# EAGLE design SparkFun-Wearable-Shield-For-Photon (EAGLE 7.1.0)
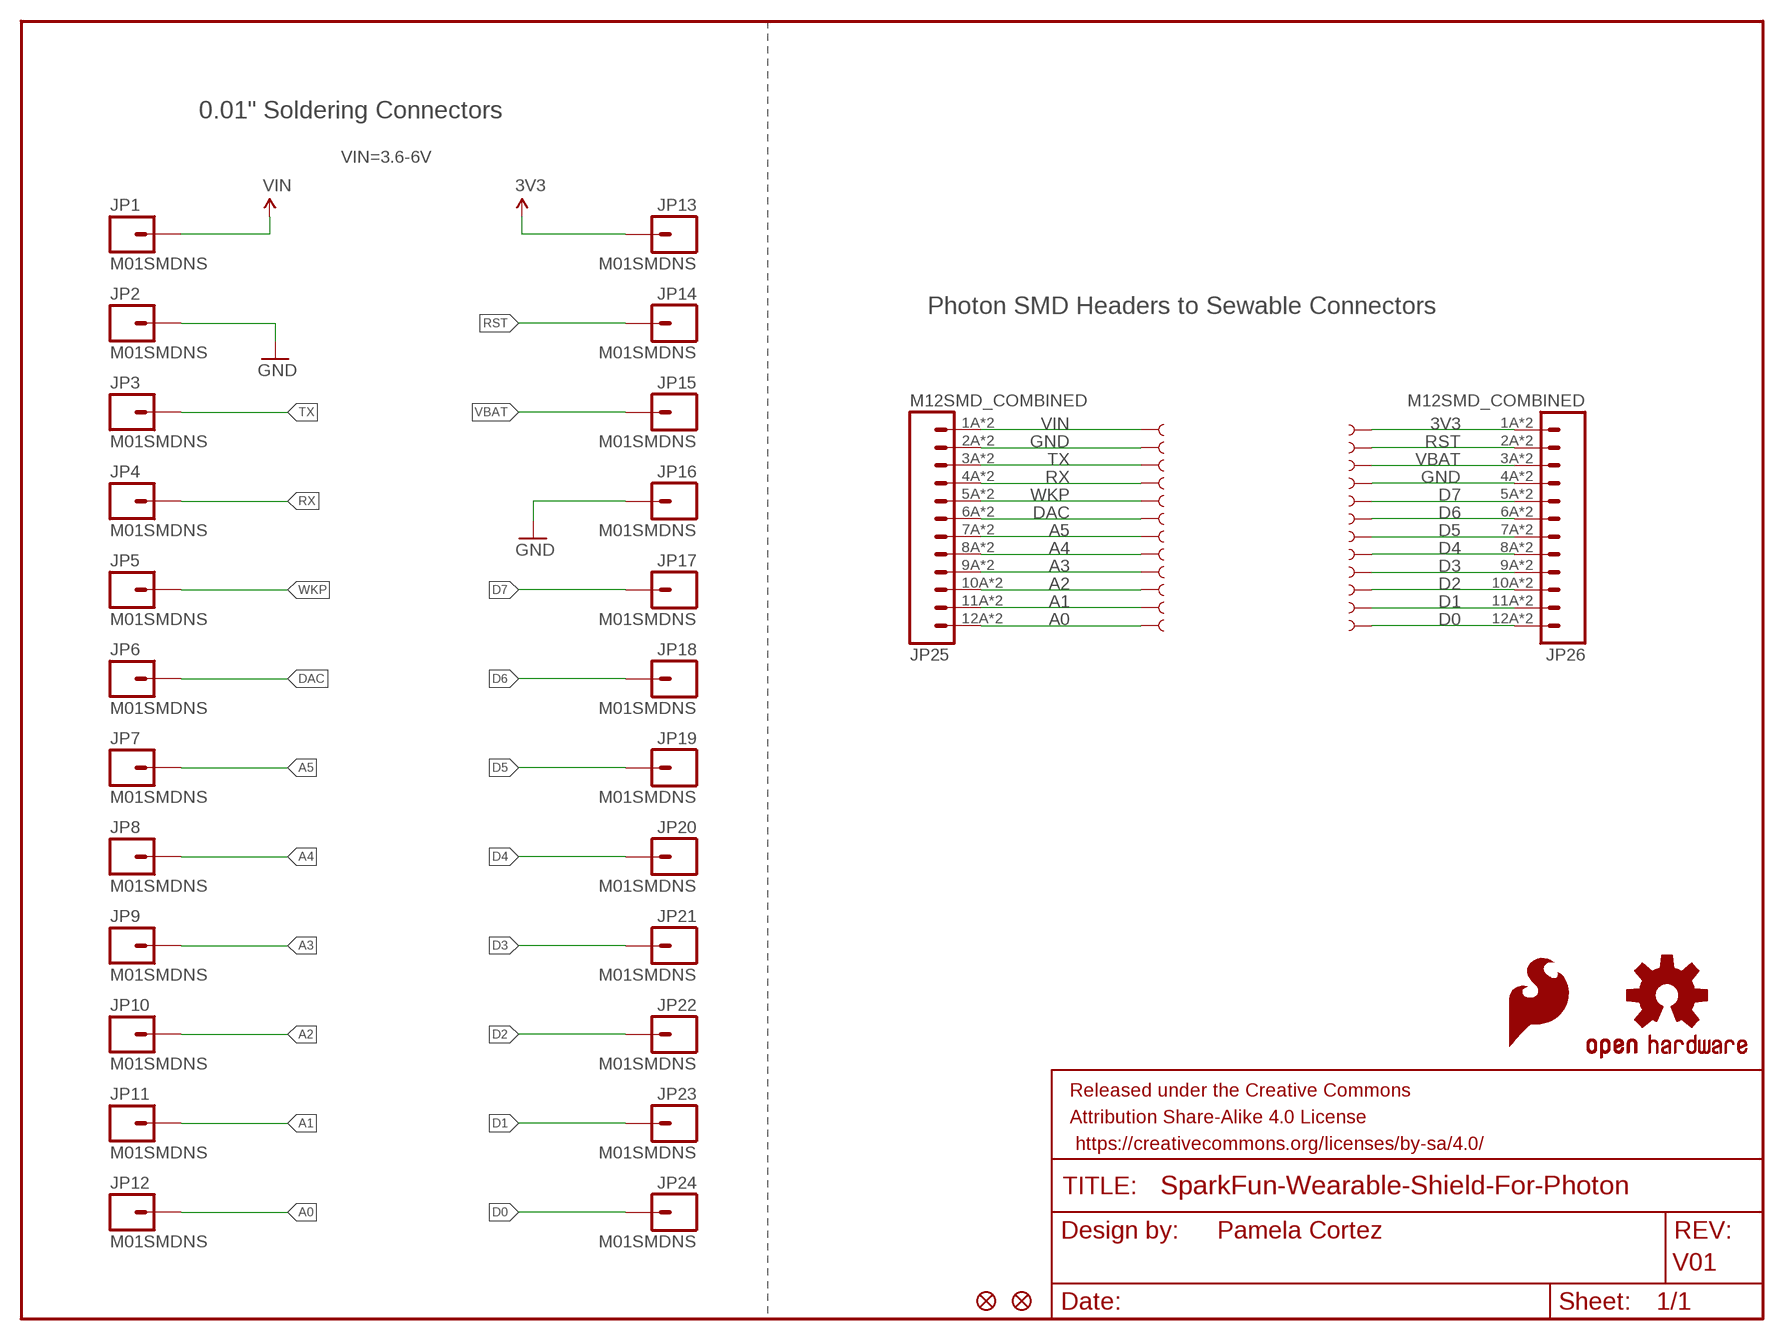
[diagram p0: schematic, sheet 1]

## Parts
FID1  FIDUCIAL1X2  [FIDUCIAL-1X2]
FID2  FIDUCIAL1X2  [FIDUCIAL-1X2]
FRAME1  FRAME-LETTER  [CREATIVE_COMMONS]
J1  PAD  [PAD-LONG-2-SIDED]
J2  PAD  [PAD-LONG-2-SIDED]
J3  PAD  [PAD-LONG-2-SIDED]
J4  PAD  [PAD-LONG-2-SIDED]
J5  PAD  [PAD-LONG-2-SIDED]
J6  PAD  [PAD-LONG-2-SIDED]
J7  PAD  [PAD-LONG-2-SIDED]
J8  PAD  [PAD-LONG-2-SIDED]
J9  PAD  [PAD-LONG-2-SIDED]
J10  PAD  [PAD-LONG-2-SIDED]
J11  PAD  [PAD-LONG-2-SIDED]
J12  PAD  [PAD-LONG-2-SIDED]
J13  PAD  [PAD-LONG-2-SIDED]
J14  PAD  [PAD-LONG-2-SIDED]
J15  PAD  [PAD-LONG-2-SIDED]
J16  PAD  [PAD-LONG-2-SIDED]
J17  PAD  [PAD-LONG-2-SIDED]
J18  PAD  [PAD-LONG-2-SIDED]
J19  PAD  [PAD-LONG-2-SIDED]
J20  PAD  [PAD-LONG-2-SIDED]
J21  PAD  [PAD-LONG-2-SIDED]
J22  PAD  [PAD-LONG-2-SIDED]
J23  PAD  [PAD-LONG-2-SIDED]
J24  PAD  [PAD-LONG-2-SIDED]
JP1  M01SMDNS  [1X01NS]
JP2  M01SMDNS  [1X01NS]
JP3  M01SMDNS  [1X01NS]
JP4  M01SMDNS  [1X01NS]
JP5  M01SMDNS  [1X01NS]
JP6  M01SMDNS  [1X01NS]
JP7  M01SMDNS  [1X01NS]
JP8  M01SMDNS  [1X01NS]
JP9  M01SMDNS  [1X01NS]
JP10  M01SMDNS  [1X01NS]
JP11  M01SMDNS  [1X01NS]
JP12  M01SMDNS  [1X01NS]
JP13  M01SMDNS  [1X01NS]
JP14  M01SMDNS  [1X01NS]
JP15  M01SMDNS  [1X01NS]
JP16  M01SMDNS  [1X01NS]
JP17  M01SMDNS  [1X01NS]
JP18  M01SMDNS  [1X01NS]
JP19  M01SMDNS  [1X01NS]
JP20  M01SMDNS  [1X01NS]
JP21  M01SMDNS  [1X01NS]
JP22  M01SMDNS  [1X01NS]
JP23  M01SMDNS  [1X01NS]
JP24  M01SMDNS  [1X01NS]
JP25  M12SMD_COMBINED  [1X12_SMD_COMBINED]
JP26  M12SMD_COMBINED  [1X12_SMD_COMBINED]
LOGO1  SFE_LOGO_FLAME.2_INCH  [SFE_LOGO_FLAME_.2]
LOGO2  OSHW-LOGOM  [OSHW-LOGO-M]

## Nets
3V3: J13.1 JP13.1 JP26.1A JP26.1B
A0: J12.1 JP12.1 JP25.12A JP25.12B
A1: J11.1 JP11.1 JP25.11A JP25.11B
A2: J10.1 JP10.1 JP25.10A JP25.10B
A3: J9.1 JP9.1 JP25.9A JP25.9B
A4: J8.1 JP8.1 JP25.8A JP25.8B
A5: J7.1 JP7.1 JP25.7A JP25.7B
D0: J24.1 JP24.1 JP26.12A JP26.12B
D1: J23.1 JP23.1 JP26.11A JP26.11B
D2: J22.1 JP22.1 JP26.10A JP26.10B
D3: J21.1 JP21.1 JP26.9A JP26.9B
D4: J20.1 JP20.1 JP26.8A JP26.8B
D5: J19.1 JP19.1 JP26.7A JP26.7B
D6: J18.1 JP18.1 JP26.6A JP26.6B
D7: J17.1 JP17.1 JP26.5A JP26.5B
DAC: J6.1 JP6.1 JP25.6A JP25.6B
GND: J2.1 J16.1 JP2.1 JP16.1 JP25.2A JP25.2B JP26.4A JP26.4B
RST: J14.1 JP14.1 JP26.2A JP26.2B
RX: J4.1 JP4.1 JP25.4A JP25.4B
TX: J3.1 JP3.1 JP25.3A JP25.3B
VBAT: J15.1 JP15.1 JP26.3A JP26.3B
VIN: J1.1 JP1.1 JP25.1A JP25.1B
WKP: J5.1 JP5.1 JP25.5A JP25.5B

## Notes on the sheet
- 0.01" Soldering Connectors
- VIN=3.6-6V
- Photon SMD Headers to Sewable Connectors
- Pamela Cortez
- V01

## Library data of the parts
FID1 FID2 = SparkFun-Aesthetics:FIDUCIAL: Fiducial Alignment Points Various fiducial points for machine vision alignment.
FRAME1 = SparkFun-Aesthetics:FRAME-LETTER: Schematic Frame Standard 8.5x11 US Letter frame; DESIGNER: NAME; VERSION: v01
J1-J24 = Photon_wearable:PAD
JP1-JP24 = SparkFun-Connectors:M01: Header 1 Standard 1-pin 0.1" header. Use with straight break away headers (SKU : PRT-00116), right angle break away headers (PRT-00553), swiss pins (PRT-00743), machine pins (PRT-00117), and female headers (PRT-00115).
JP25 JP26 = SparkFun-Connectors:M12: Header 12 Standard 12-pin 0.1" header. Use with straight break away headers (SKU : PRT-00116), right angle break away headers (PRT-00553), swiss pins (PRT-00743), machine pins (PRT-00117), and female headers (PRT-00115).; PROD_ID: (Sparkle Number)
LOGO1 = SparkFun-Aesthetics:SFE_LOGO_FLAME: SFE Logo, flame only This is the SparkFun flame logo. The logo on the schematic will always be the same size; the package variant is the height of the flame. Default layer for the logo on the board is tSilk.
LOGO2 = SparkFun-Aesthetics:OSHW-LOGO: Open Source Hardware Logo This logo indicates the piece of hardware it is found on incorporates a OSHW license and/or adheres to the definition of open source hardware found here: http://freedomdefined.org/OSHW

## Board
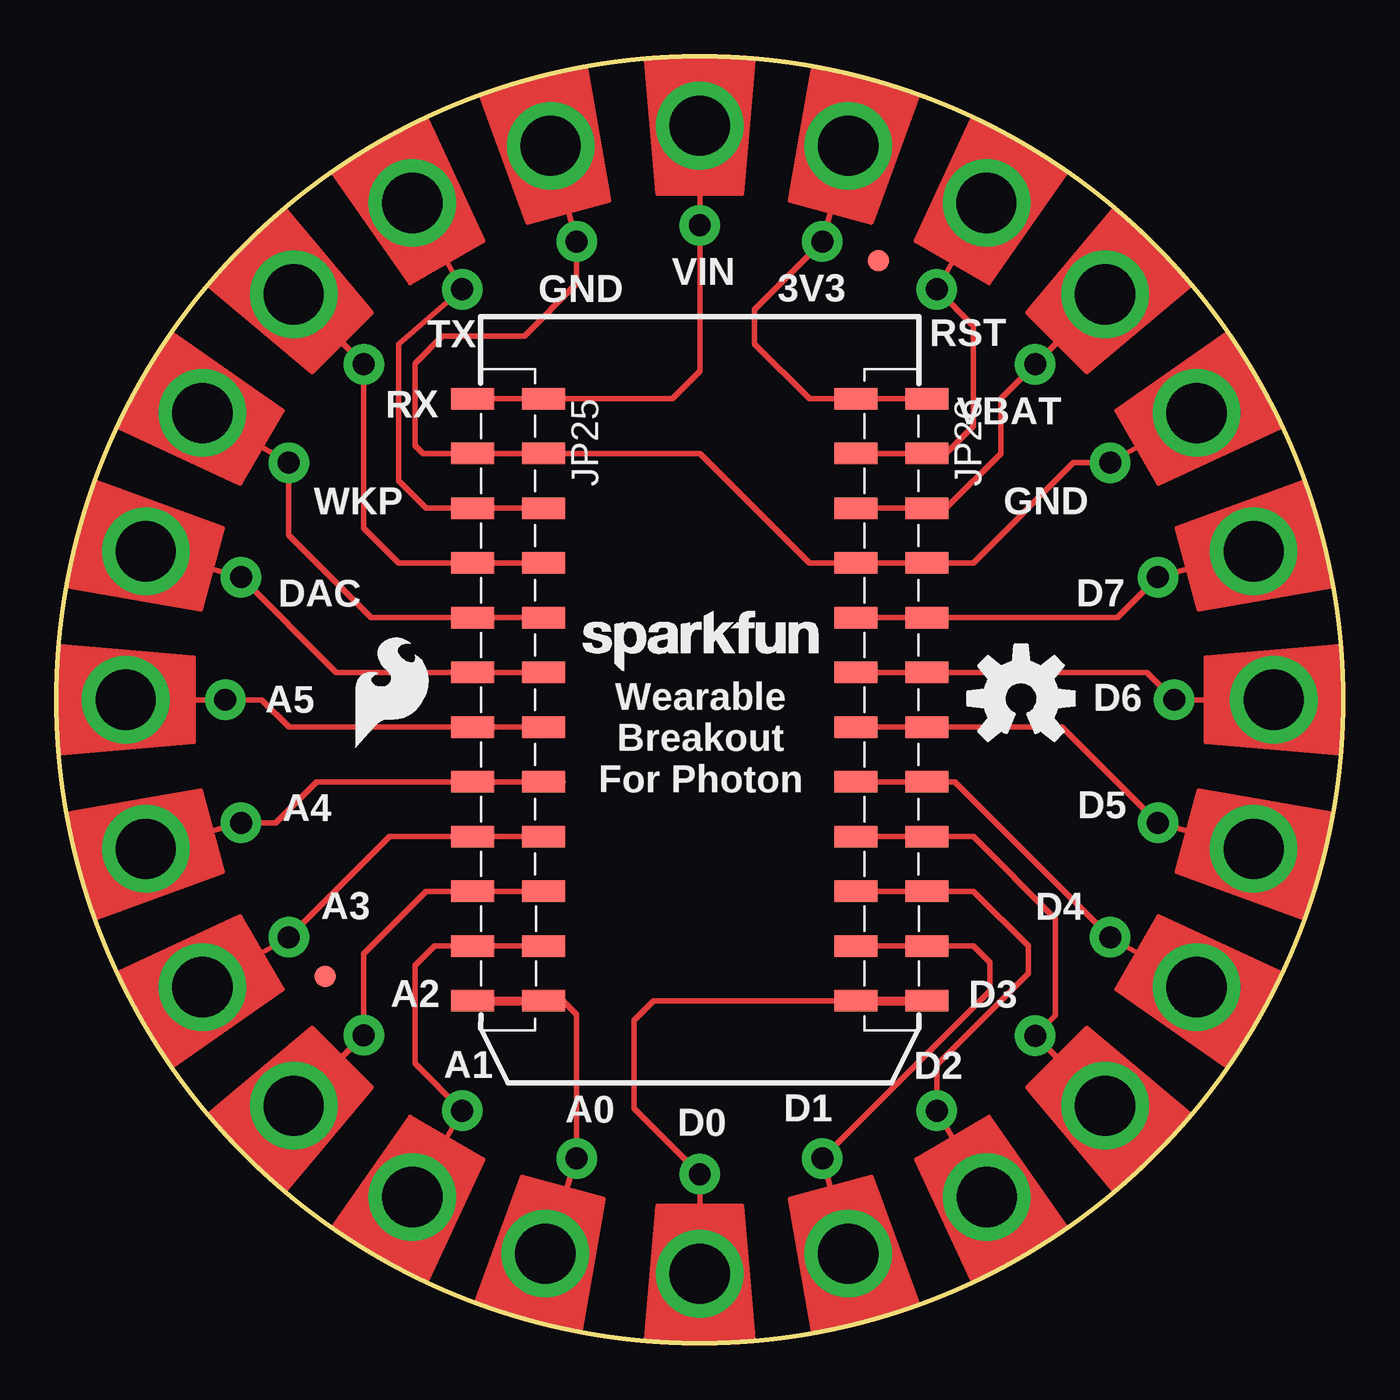
[diagram p1: board, top side]
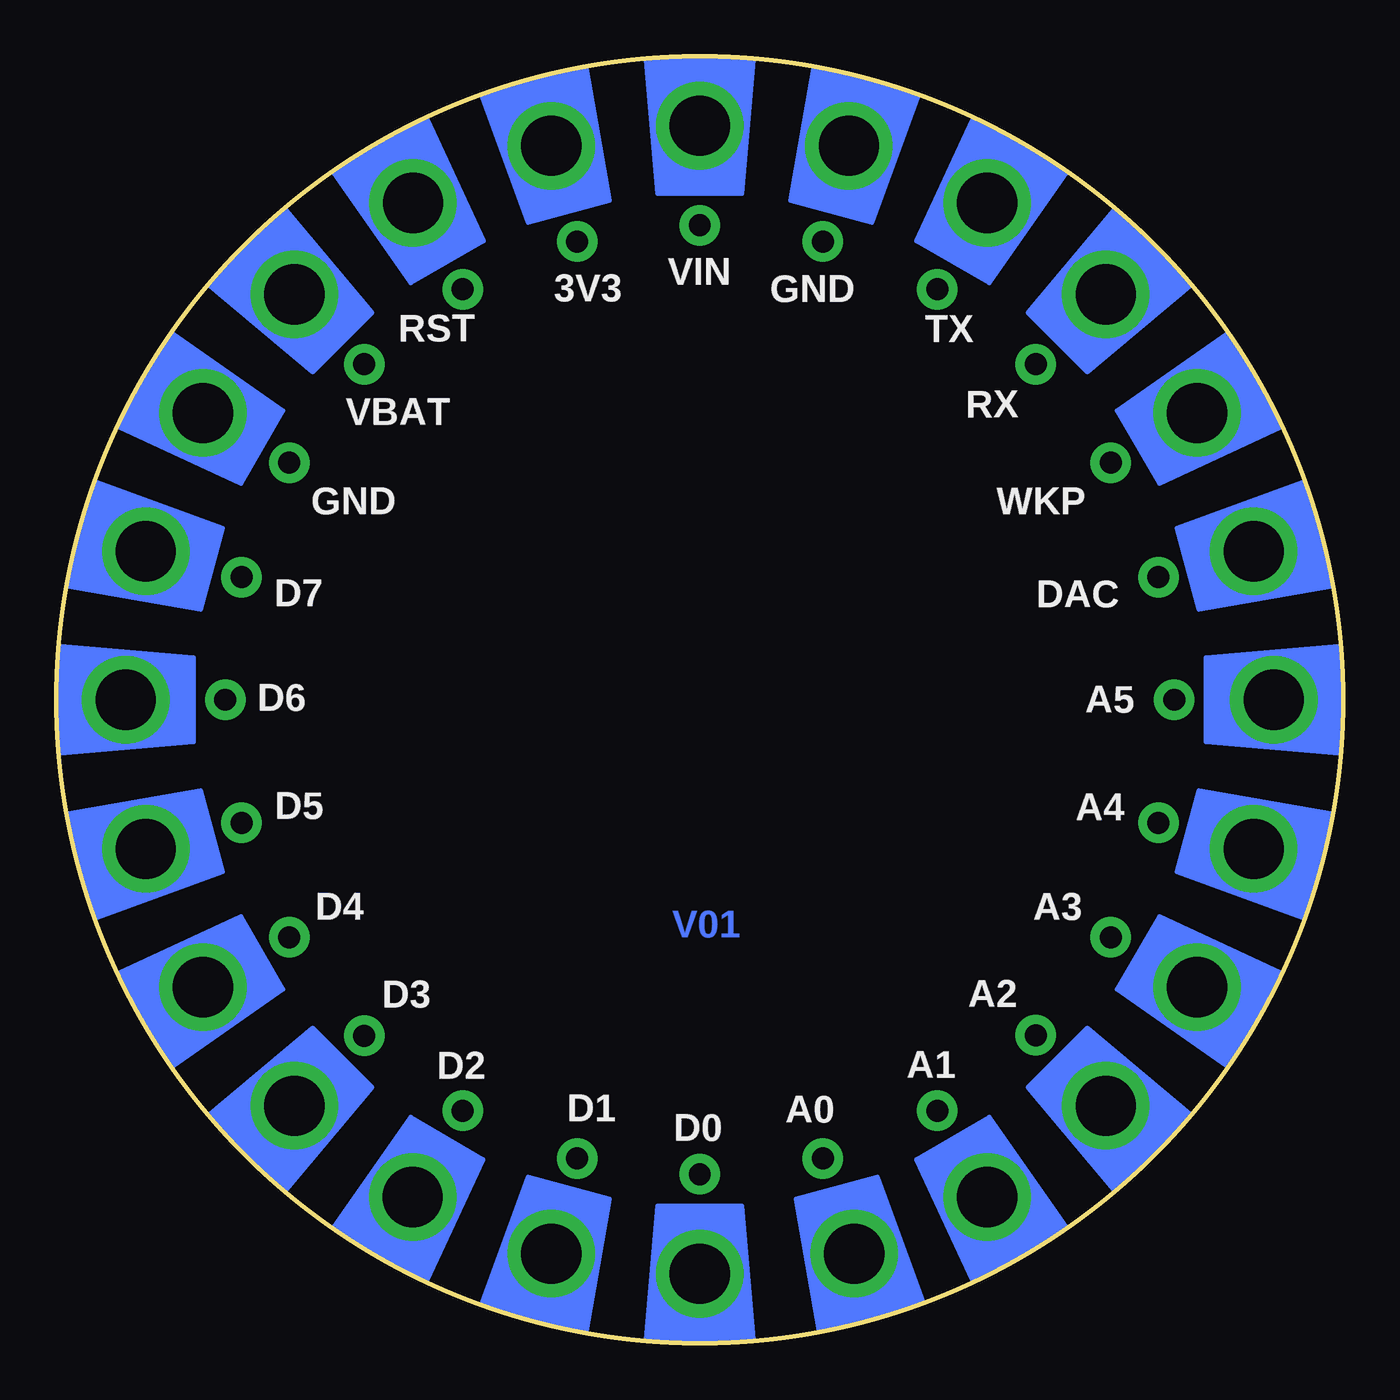
[diagram p2: board, bottom side, seen from below]

Size 59.69 x 59.69 mm. Coordinates in mm from the lower left corner, seen from the top.
Outline: circle at 29.84,29.84 radius 29.84
Copper layers (1*16): Top 0.035mm / dielectric 1.5mm / Bottom 0.035mm
Design rules "default *": minimum track width 10mil, minimum drill 24mil, track to track 8mil, track to pad 8mil, pad to pad 8mil, via to via 8mil, smd to smd 8mil, copper to edge 40mil, drill to drill 8mil, minimum pad ring 10mil, minimum via ring 8mil, stop-mask expansion 4mil, vias tented up to drill 0mil, thermal gap 10mil

### Footprints (pad centres in the part's own frame; a part is rotated, then mirrored left to right if it is on the bottom)
FIDUCIAL-1X2 = smd 1 x 1: 1 0,0
PAD-LONG-2-SIDED = drill 2.794 pad 4.064: 1 3.205,0
1X01NS = drill 1.016 pad 1.88: 1 0,0
1X12_SMD_COMBINED = smd 1 x 2: 1A 0,1.65; 1B 0,-1.65; 2A 2.54,1.65; 2B 2.54,-1.65; 3A 5.08,1.65; 3B 5.08,-1.65; 4A 7.62,1.65; 4B 7.62,-1.65; 5A 10.16,1.65; 5B 10.16,-1.65; 6A 12.7,1.65; 6B 12.7,-1.65; 7A 15.24,1.65; 7B 15.24,-1.65; 8A 17.78,1.65; 8B 17.78,-1.65; 9A 20.32,1.65; 9B 20.32,-1.65; 10A 22.86,1.65; 10B 22.86,-1.65; 11A 25.4,1.65; 11B 25.4,-1.65; 12A 27.94,1.65; 12B 27.94,-1.65

### Placement (x,y rotation side)
FID1  38.14,50.22 0 top
FID2  12.47,17 0 top
FRAME1  -2.42,-14.24 0 top  (outside the outline)
J1  29.84,59.69 270 top
J2  22.1,58.65 285 top
J3  14.91,55.68 300 top
J4  8.74,50.93 315 top
J5  3.99,44.75 330 top
J6  1.04,37.57 345 top
J7  0,29.84 0 top
J8  1.04,22.1 15 top
J9  3.99,14.91 30 top
J10  8.74,8.74 45 top
J11  14.91,3.99 60 top
J12  21.84,1.04 75 top
J13  37.57,58.65 255 top
J14  44.75,55.68 240 top
J15  50.93,50.93 225 top
J16  55.68,44.75 210 top
J17  58.65,37.57 195 top
J18  59.69,29.84 180 top
J19  58.65,22.1 165 top
J20  55.68,14.91 150 top
J21  50.93,8.74 135 top
J22  44.77,3.99 120 top
J23  37.57,1.04 105 top
J24  29.84,0 90 top
JP1  29.84,51.87 270 top
JP2  24.13,51.1 285 top
JP3  18.82,48.9 300 top
JP4  14.25,45.42 315 top
JP5  10.77,40.84 330 top
JP6  8.56,35.53 345 top
JP7  7.82,29.84 0 top
JP8  8.56,24.13 15 top
JP9  10.77,18.82 30 top
JP10  14.25,14.27 45 top
JP11  18.82,10.77 60 top
JP12  24.13,8.56 75 top
JP13  35.53,51.1 255 top
JP14  40.84,48.9 240 top
JP15  45.42,45.42 225 top
JP16  48.89,40.84 210 top
JP17  51.1,35.53 195 top
JP18  51.87,29.84 180 top
JP19  51.1,24.13 165 top
JP20  48.89,18.82 150 top
JP21  45.42,14.25 135 top
JP22  40.84,10.77 120 top
JP23  35.53,8.56 105 top
JP24  29.84,7.82 90 top
JP25  20.95,43.81 270 top
JP26  38.73,43.81 270 top
LOGO1  13.53,27.36 0 top
LOGO2  44.75,29.9 0 top
U$3  [SFE_LOGO_NAME_.1]  23.94,30.67 0 top

### Tracks (layer width: path | path; a pad name or v marks a point on that pad's centre or on a via)
3V3
  Top 0.254: JP26.1A JP26.1B 34.92,43.81 32.38,46.35 32.38,47.96 JP13.1 | JP13.1 35.53,51.13 35.56,51.16 | J13.1 JP13.1
A0
  Top 0.254: J12.1 JP12.1 24.13,15.24 23.49,15.87 JP25.12A
  Top 0.406: JP25.12B JP25.12A
A1
  Top 0.254: J11.1 JP11.1 16.63,12.96 16.63,17.51 17.53,18.41 JP25.11B JP25.11A
A2
  Top 0.254: JP25.10A JP25.10B 19.17,20.95 17.14,20.95 14.25,18.06 JP10.1 J10.1
A3
  Top 0.254: JP25.9A JP25.9B 15.44,23.49 JP9.1 J9.1
A4
  Top 0.254: 23.49,26.03 JP25.8A JP25.8B 12.06,26.03 10.16,24.13 JP8.1 J8.1
A5
  Top 0.254: JP25.7A JP25.7B 10.79,28.57 9.52,29.84 JP7.1 J7.1
D0
  Top 0.254: J24.1 JP24.1 26.79,10.88 26.79,14.97 27.69,15.88 28.44,15.88 31.69,15.88 33.51,15.87 JP26.12B 36.05,15.87
  Top 0.406: JP26.12B JP26.12A
D1
  Top 0.254: JP26.11B JP26.11A 42.54,18.41 43.3,17.66 43.3,16.32 JP23.1 J23.1
D2
  Top 0.254: JP26.10B JP26.10A 42.54,20.95 45.08,18.41 45.08,17.14 40.84,12.9 JP22.1 J22.1
D3
  Top 0.254: JP26.9B JP26.9A 42.54,23.49 46.35,19.68 46.35,15.19 JP21.1 J21.1
D4
  Top 0.254: JP26.8B JP26.8A 41.68,26.03 JP20.1 J20.1
D5
  Top 0.254: JP26.7B JP26.7A 46.66,28.57 JP19.1 J19.1
D6
  Top 0.254: JP26.6B JP26.6A 50.6,31.11 JP18.1 J18.1
D7
  Top 0.254: JP26.5B JP26.5A 49.22,33.65 JP17.1 J17.1
DAC
  Top 0.254: JP25.6A JP25.6B 12.98,31.11 JP6.1 J6.1
GND
  Top 0.254: J2.1 23.17,54.66 JP2.1 24.13,49.15 21.71,46.72 17.9,46.72 16.63,45.45 16.63,41.64 17,41.27 JP25.2B JP25.2A 29.84,41.27 34.92,36.19 JP26.4B JP26.4A 42.54,36.19 47.19,40.84 JP16.1 J16.1
RST
  Top 0.254: JP26.2B JP26.2A 41.27,41.27 42.54,42.54 42.54,47.19 JP14.1 J14.1
RX
  Top 0.254: J4.1 JP4.1 14.25,37.82 15.87,36.19 JP25.4B JP25.4A
TX
  Top 0.254: J3.1 17.09,52 JP3.1 15.87,46.35 15.87,40 17.14,38.73 JP25.3B JP25.3A
VBAT
  Top 0.254: JP26.3B JP26.3A 41.27,38.73 43.81,41.27 43.81,43.81 JP15.1 J15.1
VIN
  Top 0.254: JP25.1B JP25.1A 28.57,43.81 29.84,45.08 JP1.1 J1.1
WKP
  Top 0.254: J5.1 8.23,42.31 JP5.1 10.77,37.49 14.6,33.65 JP25.5B JP25.5A

### Text on the board
Bottom: V01
tPlace: VIN | GND | 3V3 | TX | RST | RX | VBAT | WKP | GND | DAC | D7 | A5 | D6 | Wearable / Breakout / For Photon | A4 | D5 | A3 | D4 | A2 | D3 | A1 | D2 | A0 | D1 | D0
bPlace: VIN | GND | 3V3 | TX | RST | RX | VBAT | WKP | GND | DAC | D7 | A5 | D6 | A4 | D5 | A3 | D4 | A2 | D3 | A1 | D2 | A0 | D1 | D0
tDocu: Pamela Cortez